# EasyEDA Pro project esp8266.eprj

# Schematic esp8266
Create Date: 2022-06-22; Project Name: esp8266; Schematic Name: esp8266; Update Date: 2022-10-05
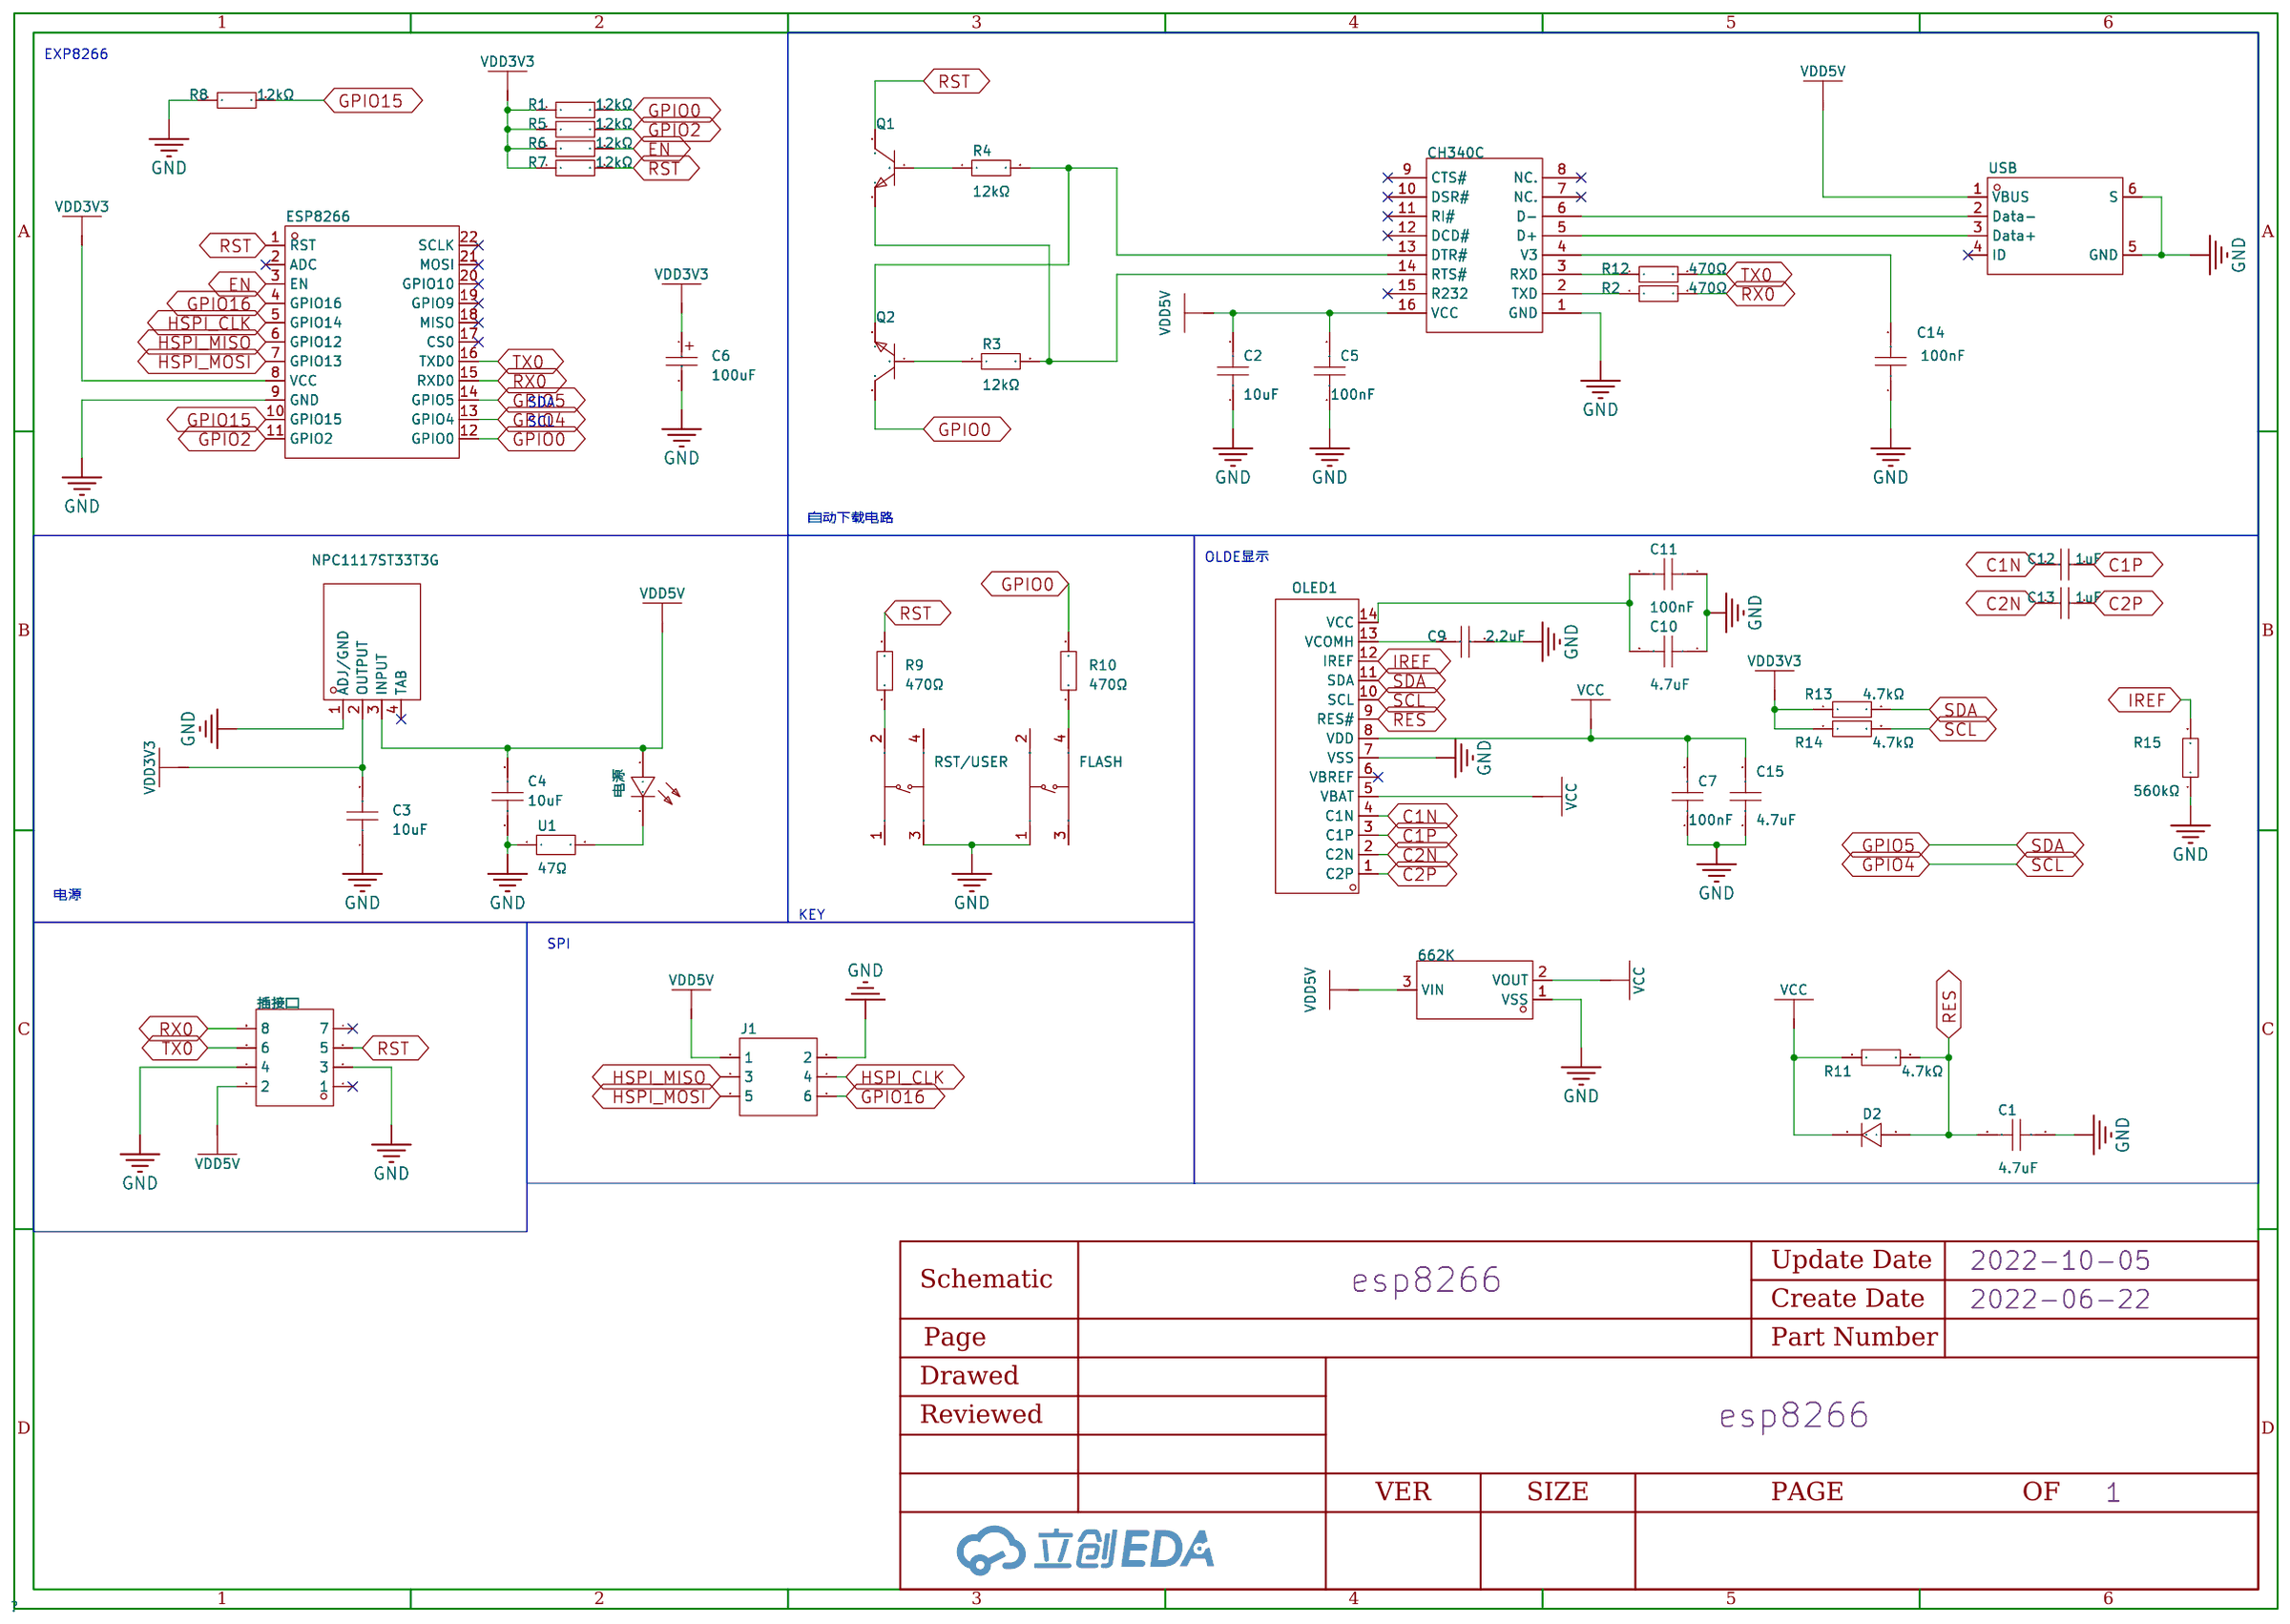
[diagram p0: schematic sheet]

## Parts
662K  -  [SOT-23-3_L2.9-W1.3-P1.90-LS2.4-BR]
C1  4.7uF  [C0805]
C2  10uF  [C0805]
C3  10uF  [C0805]
C4  10uF  [C0805]
C5  100nF  [C0805]
C6  100uF  [CAP-SMD_L3.5-W2.8-R-RD]
C7  100nF  [C0805]
C9  2.2uF  [C0805]
C10  4.7uF  [C0805]
C11  100nF  [C0805]
C12  1uF  [C0805]
C13  1uF  [C0805]
C14  100nF  [C0805]
C15  4.7uF  [C0805]
CH340C  -  [SOP-16_L10.0-W3.9-P1.27-LS6.0-BL]
D2  -  [SOD-323_L1.8-W1.3-LS2.5-RD]
ESP8266  -  [WIFIM-SMD_ESP-12F-ESP8266MOD]
FLASH  -  [SW-TH_4P-L6.0-W6.0-P4.50-LS6.5]
J1  -  [HDR-TH_6P-P2.54-V-M-R2-C3-S2.54-1]
NPC1117ST33T3G  -  [SOT-223-3_L6.5-W3.4-P2.30-LS7.0-BR]
OLED1  -  [OLED_QG-2832TLBFG02]
Q1  -  [SOT-23-3_L2.9-W1.3-P1.90-LS2.4-BR]
Q2  -  [SOT-23-3_L2.9-W1.3-P1.90-LS2.4-BR]
R1  12kΩ  [R0805]
R2  470Ω  [R0805]
R3  12kΩ  [R0805]
R4  12kΩ  [R0805]
R5  12kΩ  [R0805]
R6  12kΩ  [R0805]
R7  12kΩ  [R0805]
R8  12kΩ  [R0805]
R9  470Ω  [R0805]
R10  470Ω  [R0805]
R11  4.7kΩ  [R0805]
R12  470Ω  [R0805]
R13  4.7kΩ  [R0805]
R14  4.7kΩ  [R0805]
R15  560kΩ  [R0805]
RST/USER  -  [SW-TH_4P-L6.0-W6.0-P4.50-LS6.5]
U1  47Ω  [RES-TH_BD2.3-L3.7-P7.70-D0.4]
USB  -  [MICRO-USB-SMD_10118194-0001LF]
插接口  -  [HDR-TH_8P-P2.54-H-R2-C4-S2.54-W10.0_A2541WR]
电源  -  [LED-TH_BD3.0-P2.54-FD]

## Library data of the parts
662K = 662K.: 输出类型:-;; Supplier Part: C841298; Manufacturer: FM富满; Supplier Footprint: SOT-23-3; JLCPCB Part Class: Extended Part; Datasheet: https://atta.szlcsc.com/upload/public/pdf/watermark/20200922/C841298_3E220732626B158CD6AC195AF78C7FB8.pdf; Supplier: LCSC
C1 C15 = TMK212ABJ475KG-T: 容值:4.7uF;精度:±10%;额定电压:25V;温度系数:X5R;; LCSC Part Name: 4.7uF ±10% 25V; Supplier Part: C386082; Manufacturer: TAIYO YUDEN(太诱); Supplier Footprint: 0805; JLCPCB Part Class: Extended Part; Datasheet: https://atta.szlcsc.com/upload/public/pdf/source/20190515/C386082_C860CF0EB34FBC4D1D57494187A636A7.pdf; Supplier: LCSC; Tolerance: ±10%; Voltage Rated: 25V; Temperature Coefficient: X5R
C2-C4 = GRT21BC71E106KE13L: 容值:10uF;精度:±10%;额定电压:-;温度系数:-;; LCSC Part Name: 10uF ±10%; Supplier Part: C882505; Manufacturer: muRata(村田); Supplier Footprint: 0805; JLCPCB Part Class: Extended Part; Datasheet: https://atta.szlcsc.com/upload/public/pdf/source/20201228/C882505_6C63D8D57C6472D033E3095FB59E12C2.pdf; Supplier: LCSC; Tolerance: ±10%
C5 C7 C11 C14 = C0805X104K101T: 容值:100nF;精度:±10%;额定电压:100V;温度系数:X7R;; LCSC Part Name: 100nF ±10% 100V; Supplier Part: C485772; Manufacturer: IHHEC(禾伸堂); Supplier Footprint: 0805; JLCPCB Part Class: Extended Part; Datasheet: https://atta.szlcsc.com/upload/public/pdf/source/20200117/C485772_1C2A03D89DC7D3F931FB9AFBA2903E68.pdf; Supplier: LCSC; Tolerance: ±10%; Voltage Rated: 100V; Temperature Coefficient: X7R
C6 = TAJB107M006RNJ: 容值:100uF;精度:±20%;额定电压:6.3V;等效串联电阻:1.7Ω@100kHz;工作温度:-55~+125;; LCSC Part Name: 100uF ±20% 6.3V; Supplier Part: C7195; Manufacturer: AVX; Supplier Footprint: CASE-B_3528; JLCPCB Part Class: Extended Part; Datasheet: https://atta.szlcsc.com/upload/public/pdf/source/20160107/1457707748770.pdf; Supplier: LCSC; Tolerance: ±20%; Rated Voltage: 6.3V; Equivalent Series Resistance(ESR): 1.7Ω@100kHz; Operating Temperature: -55~+125
C9 = CL21F225ZAFNNNE: 容值:2.2uF;精度:-20%~+80%;额定电压:25V;温度系数:Y5V;; LCSC Part Name: 2.2uF(225) +80,-20% 25V; Supplier Part: C1771; Manufacturer: SAMSUNG(三星); Supplier Footprint: 0805; JLCPCB Part Class: Extended Part; Datasheet: https://atta.szlcsc.com/upload/public/pdf/source/20160103/1457707695970.pdf; Supplier: LCSC; Tolerance: -20%~+80%; Voltage Rated: 25V; Temperature Coefficient: Y5V
C10 = GRM219B31A475KE33D: 容值:4.7uF;精度:±10%;额定电压:-;温度系数:-;; LCSC Part Name: 4.7uF ±10%; Supplier Part: C913642; Manufacturer: muRata(村田); Supplier Footprint: 0805; JLCPCB Part Class: Extended Part; Datasheet: https://atta.szlcsc.com/upload/public/pdf/source/20201110/C913642_F7322AB3A970D02668ACBCDF0CD0643B.pdf; Supplier: LCSC; Tolerance: ±10%
C12 C13 = CL21F105ZOFNNNE: 容值:1uF;精度:-20%~+80%;额定电压:16V;温度系数:Y5V;; LCSC Part Name: 1uF(105) +80,-20% 16V; Supplier Part: C16834; Manufacturer: SAMSUNG(三星); Supplier Footprint: 0805; JLCPCB Part Class: Extended Part; Datasheet: https://atta.szlcsc.com/upload/public/pdf/source/20160103/1457707690495.pdf; Supplier: LCSC; Tolerance: -20%~+80%; Voltage Rated: 16V; Temperature Coefficient: Y5V
CH340C = CH340C: 类型:Transceiver;协议类别:USB 2.0;驱动器/接收器数:-;数据速率:2Mbps;; Supplier Part: C84681; Manufacturer: WCH(南京沁恒); Supplier Footprint: SOP-16_150mil; JLCPCB Part Class: Extended Part; Datasheet: https://atta.szlcsc.com/upload/public/pdf/source/20200819/C84681_ADBED554CE321879DBD6B1D06488689C.pdf; Supplier: LCSC; Type: Transceiver; Protocol: USB 2.0; Data Rate: 2Mbps; Supply Voltage: 3.3V, 5V
D2 = 1N4148WS: 二极管配置:独立式;功率:200mW;直流反向耐压(Vr):100V;平均整流电流(Io):150mA;正向压降(Vf):1.25V@150mA;反向电流(Ir):1A@75V;反向恢复时间(trr):4ns;工作温度:+150@(Tj);; LCSC Part Name: 100V 150mA 4ns T4; Supplier Part: C2128; Manufacturer: CJ（江苏长电/长晶）; Supplier Footprint: SOD-323; JLCPCB Part Class: Basic Part; Datasheet: https://atta.szlcsc.com/upload/public/pdf/source/20140809/1457707208178.pdf; Supplier: LCSC; Diode Configuration: 独立式; Power Dissipation: 200mW; Reverse Voltage (Vr): 100V; Average Rectified Current (Io): 150mA; Forward Voltage (Vf@If): 1.25V@150mA; Reverse Leakage Current: 1A@75V; Reverse Recovery Time (trr): 4ns; Operating Temperature: +150@(Tj)
ESP8266 = ESP-12F(ESP8266MOD): 屏蔽罩上的丝印是：ESP8266MOD，ESP8266EX串口WIFI; Supplier Part: C82891; Manufacturer: Ai-Thinker(安信可); Supplier Footprint: WIFI Module; JLCPCB Part Class: Extended Part; Datasheet: https://atta.szlcsc.com/upload/public/pdf/source/20210219/C82891_ABD84A460F4F056A2757267CCCA4B508.pdf; Supplier: LCSC
FLASH RST/USER = TS665CJ: 触点电流:50mA;额定电压(DC):12V;电路结构:单刀单掷;安装方式:直插;按钮形状:圆形按钮;带灯:-;开关长度:6mm;开关宽度:6mm;开关高度:5mm;; LCSC Part Name: 6*6*5插件立式直插6x6dip按键轻触开关; Supplier Part: C393938; Manufacturer: SHOU HAN(首韩); Supplier Footprint: 插件; JLCPCB Part Class: Extended Part; Datasheet: https://atta.szlcsc.com/upload/public/pdf/source/20190521/C393938_BDABEAC600B4C55E200A80AA129B70BC.pdf; Supplier: LCSC; Contact Current: 50mA; Voltage Rating (DC): 12V; Circuit: 单刀单掷; Mounting Style: 直插; Actuator Style: 圆形按钮; Switch Length: 6mm; Switch Width: 6mm; Switch Height: 5mm
J1 = 2.54-2*3P针: 间距:2.54mm;总PIN位数:6;排数:2;插针结构:-;行距:-;安装类型:直插;圆针/方针:-;额定电流:-;额定电压:-;配合针长度:-;塑高:-;触头材质:-;触头镀层:-;颜色:黑色;; LCSC Part Name: 2.54mm; Supplier Part: C65114; Manufacturer: BOOMELE(博穆精密); Supplier Footprint: 插件,P=2.54mm; JLCPCB Part Class: Extended Part; Supplier: LCSC; Pitch: 2.54mm; Number of Pins: 6; Number of Rows: 2; Mounting Type: 直插; Color: 黑色
NPC1117ST33T3G = NCP1117ST33T3G: 输出类型:固定;输出极性:正;输出通道数:1;最大输入电压:20V;输出电压:3.3V;压差:1.2V@(800mA);输出电流:1A;电源纹波抑制比(PRSS):64dB@(120Hz);; LCSC Part Name: Vin=20V Vout=3.3V 1A 64dB@(120Hz); Supplier Part: C26537; Manufacturer: onsemi(安森美); Supplier Footprint: SOT-223; JLCPCB Part Class: Extended Part; Datasheet: https://atta.szlcsc.com/upload/public/pdf/source/20140314/1457707016292.pdf; Supplier: LCSC; Output Type: 固定; Output Polarity: 正; Number of Outputs: 1; Maximum Input Voltage: 20V; Output Voltage: 3.3V; Dropout Voltage: 1.2V@(800mA); Output Current: 1A; Power Supply Rejection Ratio (PRSS): 64dB@(120Hz)
OLED1 = QG-2832TLBFG02: LCSC Part Name: QG-2832TLBFG02 蓝光14pinSSD1306; Supplier Part: C91220; Manufacturer: 全智景Allvision; Supplier Footprint: 0.91"128x32; JLCPCB Part Class: Extended Part; Datasheet: https://atta.szlcsc.com/upload/public/pdf/source/20170511/1494500131666.pdf; Supplier: LCSC
Q1 Q2 = MMBT3904: 晶体管类型:NPN;集射极击穿电压(Vceo):40V;集电极电流(Ic):200mA;功率(Pd):200mW;集电极-发射极饱和电压(VCE(sat)@Ic,Ib):300mV@50mA,5mA;直流电流增益(hFE@Ic,Vce):100@10mA,1V;特征频率(fT):300MHz;工作温度:+150@(Tj);; LCSC Part Name: MMBT3904 1AM 100-300 1AM  100-300; Supplier Part: C20526; Manufacturer: CJ（江苏长电/长晶）; Supplier Footprint: SOT-23(SOT-23-3); JLCPCB Part Class: Basic Part; Datasheet: https://atta.szlcsc.com/upload/public/pdf/source/20140809/1457707206600.pdf; Supplier: LCSC; Transistor Type: NPN; Collector-Emitter Breakdown Voltage (Vceo): 40V; Collector Current (Ic): 200mA; Power Dissipation (Pd): 200mW; Collector-Emitter Saturation Voltage (VCE(sat)@Ic,Ib): 300mV@50mA,5mA; DC Current Gain (hFE@Ic,Vce): 100@10mA,1V; Transition Frequency (fT): 300MHz; Operating Temperature: +150@(Tj)
R1 R3-R8 = 0805W8F1202T5E: 电阻类型:厚膜电阻;阻值:12kΩ;精度:±1%;功率:125mW;温度系数:±100ppm/;最大工作电压:150V;工作温度范围:-55~+155;; LCSC Part Name: 12kΩ ±1%; Supplier Part: C17444; Manufacturer: UNI-ROYAL(厚声); Supplier Footprint: 0805; JLCPCB Part Class: Basic Part; Datasheet: https://atta.szlcsc.com/upload/public/pdf/source/20200306/C422600_1E6D84923E4A46A82E41ADD87F860B5C.pdf; Supplier: LCSC; Type: 厚膜电阻; Tolerance: ±1%; Power(Watts): 125mW; Temperature Coefficient: ±100ppm/; Overload Voltage (Max): 150V; Operating Temperature Range: -55~+155
R2 R9 R10 R12 = RS-05K4700FT: 阻值:470Ω;精度:±1%;功率:125mW;温度系数:±100ppm/;最大工作电压:100V;工作温度范围:-55~+155;; LCSC Part Name: 470Ω ±1%; Supplier Part: C136570; Manufacturer: FH(风华); Supplier Footprint: 0805; JLCPCB Part Class: Extended Part; Datasheet: https://atta.szlcsc.com/upload/public/pdf/source/20171106/C136570_15099531895241092516.pdf; Supplier: LCSC; Tolerance: ±1%; Power(Watts): 125mW; Temperature Coefficient: ±100ppm/; Overload Voltage (Max): 100V; Operating Temperature Range: -55~+155
R11 R13 R14 = RMC08054.7K1%N: 阻值:4.7kΩ;精度:±1%;功率:0.125W;; LCSC Part Name: 4.7kΩ ±1%; Supplier Part: C269746; Manufacturer: Tyohm(幸亚电阻); Supplier Footprint: 0805; JLCPCB Part Class: Extended Part; Datasheet: https://atta.szlcsc.com/upload/public/pdf/source/20190115/C269746_3EA3C7E4490C68712FA44CA03852E2BD.pdf; Supplier: LCSC; Tolerance: ±1%; Power(Watts): 0.125W
R15 = 0805W8F5603T5E: 电阻类型:厚膜电阻;阻值:560kΩ;精度:±1%;功率:1/8W;温度系数:±100ppm/;最大工作电压:150V;工作温度范围:-55~+155;; LCSC Part Name: 560kΩ ±1%; Supplier Part: C15785; Manufacturer: UNI-ROYAL(厚声); Supplier Footprint: 0805; JLCPCB Part Class: Extended Part; Datasheet: https://atta.szlcsc.com/upload/public/pdf/source/20200306/C422600_1E6D84923E4A46A82E41ADD87F860B5C.pdf; Supplier: LCSC; Type: 厚膜电阻; Tolerance: ±1%; Power(Watts): 1/8W; Temperature Coefficient: ±100ppm/; Overload Voltage (Max): 150V; Operating Temperature Range: -55~+155
U1 = MF1/8W-47Ω±1%-OT52: 电阻类型:金属膜电阻;阻值:47Ω;精度:±1%;功率:125mW;温度系数:±350ppm/;最大工作电压:200V;工作温度范围:-55~+155;; LCSC Part Name: 47Ω ±1% 125mW; Supplier Part: C2848560; Manufacturer: VO(翔胜); Supplier Footprint: 轴向引线,2.3x3.7mm; Datasheet: https://atta.szlcsc.com/upload/public/pdf/source/20200609/C601728_5AA4C0C8E12E11069DA2C3356F29D1F2.pdf; Supplier: LCSC; Type: 金属膜电阻; Tolerance: ±1%; Power(Watts): 125mW; Temperature Coefficient: ±350ppm/; Overload Voltage (Max): 200V; Operating Temperature Range: -55~+155
USB = 10118194-0001LF: 连接器类型:Micro-B;标准:USB 2.0;公母:母座;触点数量:5;端口数量:1;; LCSC Part Name: Micro-B 母座; Supplier Part: C132563; Manufacturer: Amphenol; Supplier Footprint: SMD; JLCPCB Part Class: Extended Part; Datasheet: https://atta.szlcsc.com/upload/public/pdf/source/20210630/C132563_323781699BE9D7BFAD8DF70EA5820798.pdf; Supplier: LCSC; Connector Type: Micro-B; Standard: USB 2.0; Gender: 母座; Number of Contacts: 5; Number of Ports: 1
插接口 = A2541WR-2x4P: 间距:2.54mm;总PIN位数:8;排数:2;插针结构:2x4P;行距:2.54mm;安装类型:弯插;圆针/方针:方针;额定电流:-;额定电压:-;配合针长度:6mm;塑高:2.54mm;触头材质:黄铜;触头镀层:-;工作温度范围:-40~+105;颜色:黑色;; LCSC Part Name: 2.54mm 2x4P; Supplier Part: C239335; Manufacturer: CJT(长江连接器); Supplier Footprint: 插件,P=2.54mm; JLCPCB Part Class: Extended Part; Datasheet: https://atta.szlcsc.com/upload/public/pdf/source/20180724/C239335_1CBAC3B8C59C1FC155DA41FC3F737A16.pdf; Supplier: LCSC; Pitch: 2.54mm; Number of Pins: 8; Number of Rows: 2; Pin Structure: 2x4P; Row Spacing: 2.54mm; Mounting Type: 弯插; Circluar Pins/Square Pins: 方针; Length of Mating Pin: 6mm; Insulation Height: 2.54mm; Contact Material: 黄铜; Operating Temperature Range: -40~+105; Color: 黑色
电源 = 204-10SURD/S530-A3-L: 发光颜色:红灯;二极管配置:-;透镜颜色:雾状红;主波长:624nm;峰值波长:632nm;色温:-;光通量(25时):-;测试电流:20mA;正向电压(VF):2V;发光强度:80mcd;功率:60mW;发光角度:40°;安装方式:-;工作温度:-40~+85;; LCSC Part Name: 红色; Supplier Part: C99771; Manufacturer: EVERLIGHT(台湾亿光); Supplier Footprint: 插件,φ=3mm; JLCPCB Part Class: Extended Part; Datasheet: https://atta.szlcsc.com/upload/public/pdf/source/20170504/1493866972127.pdf; Supplier: LCSC; Emitted Color: 红灯; Lens Color: 雾状红; Dominant Wavelength: 624nm; Peak Wavelength: 632nm; Forward Current: 20mA; Forward Voltage (VF): 2V; Luminous Intensity: 80mcd; Power Dissipation: 60mW; Viewing Angle: 40°; Operating Temperature: -40~+85

## Nets
GND: 662K.1(VSS) C1.1 C2.1 C3.1 C4.1 C5.1 C6.2 C7.1 C9.1 C10.1 C11.1 C14.1 C15.1 CH340C.1(GND) ESP8266.9(GND) FLASH.1(A) J1.2 NPC1117ST33T3G.1(ADJ/GND) OLED1.7(VSS) R8.1 R15.1 RST/USER.3(C) U1.1 USB.5(GND) USB.6(S) 插接口.3 插接口.4
VCC: 662K.2(VOUT) C7.2 C15.2 D2.1(K) OLED1.5(VBAT) OLED1.8(VDD) R11.1
VDD3V3: C3.2 C6.1 ESP8266.8(VCC) NPC1117ST33T3G.2(OUTPUT) R1.1 R5.1 R6.1 R7.1 R13.1 R14.1
VDD5V: 662K.3(VIN) C2.2 C4.2 C5.2 CH340C.16(VCC) J1.1 NPC1117ST33T3G.3(INPUT) USB.1(VBUS) 插接口.2 电源.1(A)
C1N: C12.2 OLED1.4(C1N)
C1P: C12.1 OLED1.3(C1P)
C2N: C13.1 OLED1.2(C2N)
C2P: C13.2 OLED1.1(C2P)
EN: ESP8266.3(EN) R6.2
GPIO0: ESP8266.12(GPIO0) Q2.3(C) R1.2 R10.2
GPIO2: ESP8266.11(GPIO2) R5.2
GPIO4: ESP8266.13(GPIO4) OLED1.10(SCL) R14.2
GPIO5: ESP8266.14(GPIO5) OLED1.11(SDA) R13.2
GPIO15: ESP8266.10(GPIO15) R8.2
GPIO16: ESP8266.4(GPIO16) J1.6
HSPI_CLK: ESP8266.5(GPIO14) J1.4
HSPI_MISO: ESP8266.6(GPIO12) J1.3
HSPI_MOSI: ESP8266.7(GPIO13) J1.5
IREF: OLED1.12(IREF) R15.2
RES: C1.2 D2.2(A) OLED1.9(RES#) R11.2
RST: ESP8266.1(RST) Q1.3(C) R7.2 R9.2 插接口.5
RX0: ESP8266.15(RXD0) R2.2 插接口.8
TX0: ESP8266.16(TXD0) R12.2 插接口.6
$1N2489: CH340C.5(D+) USB.3(Data+)
$1N2492: CH340C.6(D-) USB.2(Data-)
$1N4762: CH340C.2(TXD) R2.1
$1N5427: CH340C.14(RTS#) Q1.2(E) R3.2
$1N6150: Q1.1(B) R4.1
$1N6309: Q2.1(B) R3.1
$1N11619: R9.1 RST/USER.2(B)
$1N11632: FLASH.4(D) R10.1
$1N12597: CH340C.13(DTR#) Q2.2(E) R4.2
$1N12808: CH340C.3(RXD) R12.1
$1N12994: C14.2 CH340C.4(V3)
$1N28480: C10.2 C11.2 OLED1.14(VCC)
$1N28820: C9.2 OLED1.13(VCOMH)
$1N39199: U1.2 电源.2(K)

Not connected (* = marked no-connect by the designer): CH340C 7(NC.)* 8(NC.)* 9(CTS#)* 10(DSR#)* 11(RI#)* 12(DCD#)* 15(R232)*; ESP8266 2(ADC)* 17(CS0)* 18(MISO)* 19(GPIO9)* 20(GPIO10)* 21(MOSI)* 22(SCLK)*; FLASH 2(B) 3(C); NPC1117ST33T3G 4(TAB)*; OLED1 6(VBREF)*; RST/USER 1(A) 4(D); USB 4(ID)*; 插接口 1* 7*

## Notes on the sheet
- EXP8266
- SDA
- SCL
- 自动下载电路
- OLDE显示
- 电源
- KEY
- SPI

# Board PCB1
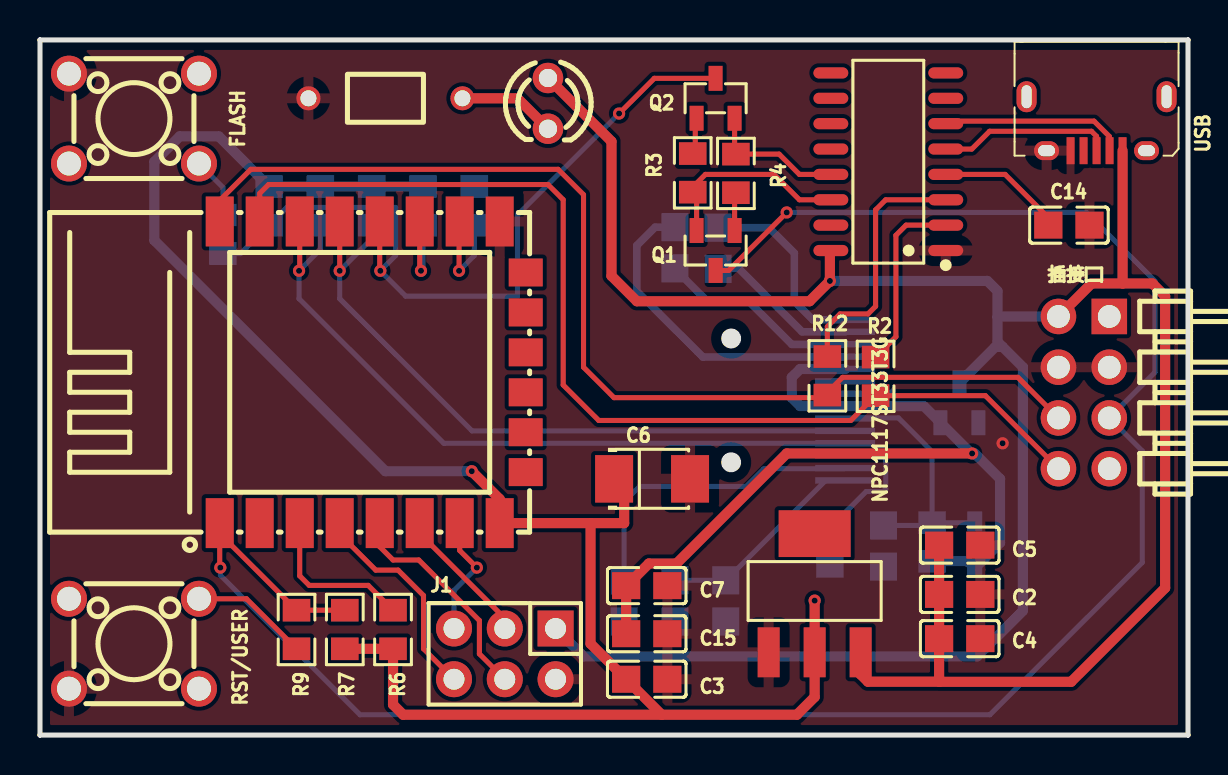
[diagram p1: board, top side]
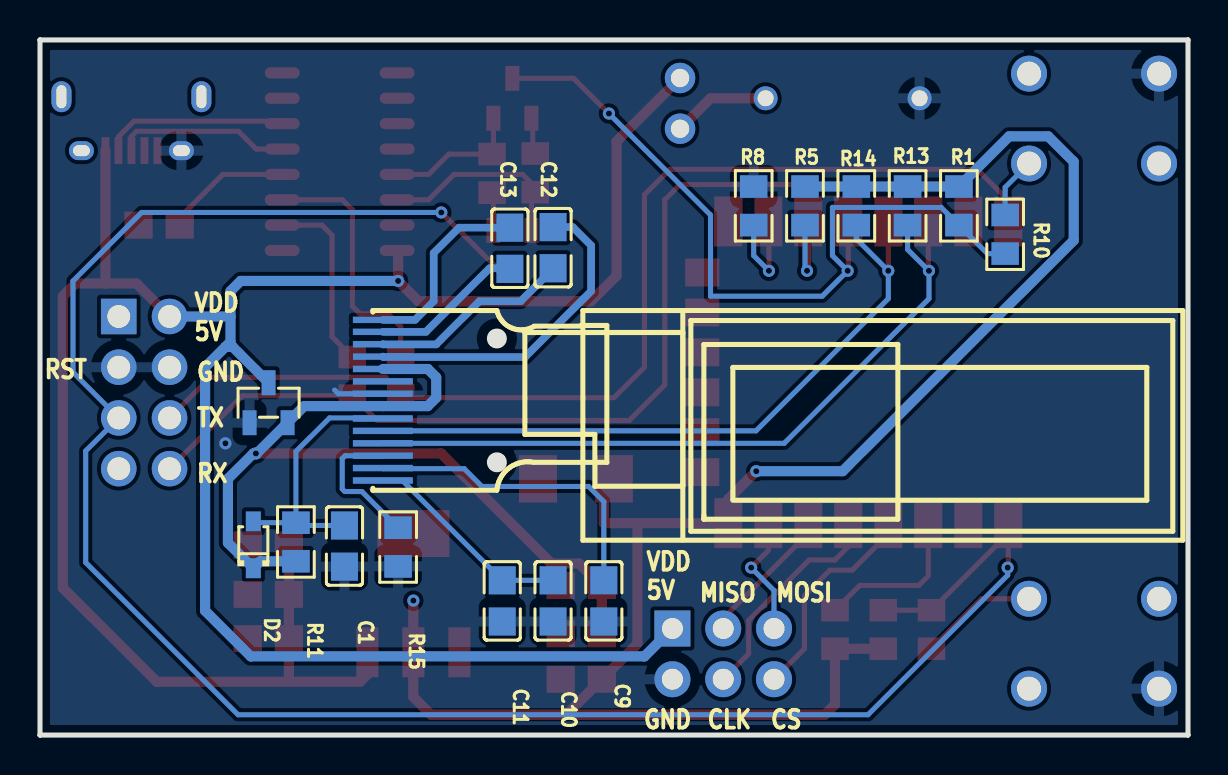
[diagram p2: board, bottom side, seen from below]

Outline 57.4 x 34.8 mm; copper layers: Top Layer, Bottom Layer. Coordinates in mm from the lower left corner of the outline.
Outline path: 0,34.8 0,0 arc(0,0) 0,0 57.4,0 57.4,34.8 0,34.8 arc(0,34.8) 0,34.8
Stack: Top Layer 0.035mm / Dielectric1 1.51mm FR4 er 4.5 / Bottom Layer 0.035mm

## Design rules (mm)
spacing safeClearance (default): track to track 0.152, other pairs 0.152 to 0.3
track width trackWidth (default): min 0.127, default 0.254, max 2.54
differential pair differentialPair (default): width min 0.127, default 0.254, max 2.54; gap min 0.152, default 0.152
via viaSize (default): diameter min 0.5, default 0.61, max 10; hole min 0.3, default 0.305, max 6

## Placement (name value [footprint] x y rotation side)
662K  -  [SOT-23-3_L2.9-W1.3-P1.90-LS2.4-BR]  45.97 16.64 270 bottom
C1  4.7uF  [C0805]  42.18 9.46 90 bottom
C2  10uF  [C0805]  45.99 7.04 180 top
C3  10uF  [C0805]  30.34 2.79 180 top
C4  10uF  [C0805]  45.99 4.83 180 top
C5  100nF  [C0805]  45.99 9.51 180 top
C6  100uF  [CAP-SMD_L3.5-W2.8-R-RD]  30.61 12.83 180 top
C7  100nF  [C0805]  30.34 7.48 180 top
C9  2.2uF  [C0805]  29.21 6.72 90 bottom
C10  4.7uF  [C0805]  31.75 6.72 90 bottom
C11  100nF  [C0805]  34.29 6.72 90 bottom
C12  1uF  [C0805]  31.75 24.4 90 bottom
C13  1uF  [C0805]  33.91 24.37 90 bottom
C14  100nF  [C0805]  51.45 25.53 180 top
C15  4.7uF  [C0805]  30.34 5.07 180 top
CH340C  -  [SOP-16_L10.0-W3.9-P1.27-LS6.0-BL]  42.42 28.7 90 top
D2  -  [SOD-323_L1.8-W1.3-LS2.5-RD]  46.74 9.53 90 bottom
ESP8266  -  [WIFIM-SMD_ESP-12F-ESP8266MOD]  16.64 18.16 0 top
FLASH  -  [SW-TH_4P-L6.0-W6.0-P4.50-LS6.5]  4.7 30.86 0 top
J1  -  [HDR-TH_6P-P2.54-V-M-R2-C3-S2.54-1]  23.24 4.06 180 top
NPC1117ST33T3G  -  [SOT-223-3_L6.5-W3.4-P2.30-LS7.0-BR]  38.73 7.11 270 top
OLED1  -  [OLED_QG-2832TLBFG02]  40.26 16.76 90 bottom
Q1  -  [SOT-23-3_L2.9-W1.3-P1.90-LS2.4-BR]  33.78 24.26 90 top
Q2  -  [SOT-23-3_L2.9-W1.3-P1.90-LS2.4-BR]  33.78 31.88 270 top
R1  12kΩ  [R0805]  11.46 26.49 270 bottom
R2  470Ω  [R0805]  41.78 17.96 270 top
R3  12kΩ  [R0805]  32.64 28.14 270 top
R4  12kΩ  [R0805]  34.8 28.12 90 top
R5  12kΩ  [R0805]  19.15 26.49 270 bottom
R6  12kΩ  [R0805]  17.65 5.28 90 top
R7  12kΩ  [R0805]  15.24 5.28 90 top
R8  12kΩ  [R0805]  21.72 26.49 270 bottom
R9  470Ω  [R0805]  12.83 5.28 90 top
R10  470Ω  [R0805]  9.14 25.07 270 bottom
R11  4.7kΩ  [R0805]  44.61 9.67 90 bottom
R12  470Ω  [R0805]  39.37 17.98 270 top
R13  4.7kΩ  [R0805]  14.02 26.49 270 bottom
R14  4.7kΩ  [R0805]  16.59 26.49 270 bottom
R15  560kΩ  [R0805]  39.5 9.41 90 bottom
RST/USER  -  [SW-TH_4P-L6.0-W6.0-P4.50-LS6.5]  4.7 4.57 0 top
U1  47Ω  [RES-TH_BD2.3-L3.7-P7.70-D0.4]  17.27 31.88 0 top
USB  -  [MICRO-USB-SMD_10118194-0001LF]  52.83 30.61 180 top
插接口  -  [HDR-TH_8P-P2.54-H-R2-C4-S2.54-W10.0_A2541WR]  52.2 17.15 270 top
电源  -  [LED-TH_BD3.0-P2.54-FD]  25.4 31.62 270 top

## Footprints (pads in the part's own frame, mm; a bottom-side part is the same pattern mirrored in y, then rotated)
C0805
  rect 1.41x1.35 smd: 1(-1.03,0) 2(1.03,0)
CAP-SMD_L3.5-W2.8-R-RD
  rect 1.9x2.375 smd: 1(1.9,0) 2(-1.897,0)
HDR-TH_6P-P2.54-V-M-R2-C3-S2.54-1
  rect 1.801x1.801 hole 1.049: 1(-2.54,-1.27)
  round 1.801 hole 1.049: 2(-2.54,1.27) 3(0,-1.27) 4(0,1.27) 5(2.54,-1.27) 6(2.54,1.27)
HDR-TH_8P-P2.54-H-R2-C4-S2.54-W10.0_A2541WR
  rect 1.778x1.778 hole 1.143: 1(-3.81,1.27)
  round 1.778 hole 1.143: 2(-3.81,-1.27) 3(-1.27,1.27) 4(-1.27,-1.27) 5(1.27,1.27) 6(1.27,-1.27) 7(3.81,1.27) 8(3.81,-1.27)
LED-TH_BD3.0-P2.54-FD
  round 1.524 hole 0.914: 1(-1.27,0) 2(1.27,0)
MICRO-USB-SMD_10118194-0001LF
  rect 0.399x1.351 smd: 1(-1.3,1.351) 2(-0.65,1.351) 3(0,1.351) 4(0.65,1.351) 5(1.3,1.351)
  oval 1.001x1.55 hole 0.5x1.151: 6(-3.5,-1.349) 6(3.5,-1.349)
  oval 1.25x0.95 hole 0.851x0.551: 6(-2.499,1.351) 6(2.499,1.351)
OLED_QG-2832TLBFG02
  rect 0.32x2.999 smd: 1(4.021,0) 2(3.421,0) 3(2.801,0) 4(2.182,0) 5(1.562,0) 6(0.943,0) 7(0.323,0) 8(-0.297,0) 9(-0.917,0) 10(-1.536,0) 11(-2.159,0) 12(-2.779,0) 13(-3.398,0) 14(-4.019,0)
R0805
  rect 1.133x1.377 smd: 1(-0.966,0) 2(0.966,0)
RES-TH_BD2.3-L3.7-P7.70-D0.4
  round 1.2 hole 0.8: 1(-3.85,0) 2(3.85,0)
SOD-323_L1.8-W1.3-LS2.5-RD
  rect 1x0.75 smd: 1(-1.173,0) 2(1.173,0)
SOP-16_L10.0-W3.9-P1.27-LS6.0-BL
  oval 0.56x1.745 smd: 1(-4.445,-2.873) 2(-3.175,-2.873) 3(-1.905,-2.873) 4(-0.635,-2.873) 5(0.635,-2.873) 6(1.905,-2.873) 7(3.175,-2.873) 8(4.445,-2.873) 9(4.445,2.873) 10(3.175,2.873) 11(1.905,2.873) 12(0.635,2.873) 13(-0.635,2.873) 14(-1.905,2.873) 15(-3.175,2.873) 16(-4.445,2.873)
SOT-23-3_L2.9-W1.3-P1.90-LS2.4-BR
  rect 1.25x0.7 smd: 1(1,-0.95) 2(1,0.95) 3(-1,0)
SOT-223-3_L6.5-W3.4-P2.30-LS7.0-BR
  rect 2.5x1.1 smd: 1(2.97,-2.3) 2(2.97,0) 3(2.97,2.3)
  rect 2.34x3.6 smd: 4(-2.97,0)
SW-TH_4P-L6.0-W6.0-P4.50-LS6.5
  round 1.8 hole 1.2: 1(-3.25,2.25) 2(3.25,2.25) 3(-3.25,-2.25) 4(3.25,-2.25)
WIFIM-SMD_ESP-12F-ESP8266MOD
  rect 1.399x2.499 smd: 1(-7.651,-7.551) 2(-5.652,-7.551) 3(-3.65,-7.551) 4(-1.651,-7.551) 5(0.35,-7.551) 6(2.349,-7.551) 7(4.348,-7.551) 8(6.35,-7.551) 9(6.35,7.549) 10(4.348,7.551) 11(2.349,7.551) 12(0.35,7.551) 13(-1.651,7.549) 14(-3.65,7.551) 15(-5.652,7.551) 16(-7.651,7.551)
  rect 1.7x1.399 smd: 17(7.651,-4.998) 18(7.648,-3.002) 19(7.651,-1.004) 20(7.651,0.998) 21(7.651,2.997) 22(7.651,4.996)

## Nets
As in the schematic.

Pads without a net: CH340C 7 8 9 10 11 12 15; ESP8266 2 17 18 19 20 21 22; FLASH 2 3; NPC1117ST33T3G 4; OLED1 6; RST/USER 1 4; USB 4; 插接口 1 7

## Via types
v1: diameter 0.61, hole 0.305, Top Layer to Bottom Layer, 14 vias

## Routing (per net, layer and track width the routed paths; a pad name or vN(x,y) marks a point on that pad's centre or on a via; arc(x,y) is an arc through that point)
GND: length 2.5
  Bottom Layer w0.254: OLED1.7 42.49,17.09 42.67,17.27
  vias: v1(48.13,14.61)
VCC: length 45.7
  Top Layer w0.508: v1(46.61,14.1) 37.34,14.1 31.83,8.59 30.45,8.59 29.34,7.48 C7.2 C15.2
  Bottom Layer w0.508: R11.1 46.39,8.7 D2.1 48.01,9.62 48.01,12.83 46.74,14.1 46.56,14.1 44.19,16.47 OLED1.8 38.02,16.47 37.59,16.89 37.59,17.91 38.01,18.33 OLED1.5
VDD3V3: length 94.6
  Top Layer w0.508: 17.65,4.32 17.65,1.52 18.16,1.02 31.09,1.02 ; 17.65,4.32 15.24,4.32 ; 17.65,4.32 17.72,4.32 ; 27.53,10.61 27.53,4.57 C3.2 31.09,1.02 ; 27.53,10.61 ESP8266.8 22.99,11.81 v1(21.59,13.21) ; 27.53,10.61 29.21,10.61 29.21,12.32 28.8,12.74 28.74,12.74 28.74,12.8 C6.1 ; 31.09,1.02 37.85,1.02 38.73,1.91 NPC1117ST33T3G.2 v1(38.73,6.73) ; 17.72,4.32 17.84,4.32 17.78,4.25 17.72,4.32
  Bottom Layer w0.508: R5.1 R14.1 R13.1 R1.1 8.94,29.97 6.98,29.97 5.71,28.7 5.71,24.77 17.27,13.21 v1(21.59,13.21)
VDD5V: length 133.4
  Top Layer w0.508: 54.13,22.61 52.58,22.61 插接口.2 ; 54.13,22.61 55.63,22.61 56.26,21.97 56.26,7.37 51.56,2.67 44.96,2.67 44.96,2.67 ; 54.13,22.61 USB.1 ; NPC1117ST33T3G.3 41.03,3.03 41.4,2.67 44.96,2.67 ; 电源.1 28.58,29.72 28.58,22.99 29.84,21.72 38.48,21.72 v1(39.5,22.73) 39.5,24.21 CH340C.16 ; C5.2 C2.2 C4.2 44.96,2.67
  Bottom Layer w0.508: v1(39.5,22.73) 47.37,22.73 47.88,22.23 47.88,20.93 ; 47.88,20.93 47.9,20.95 插接口.2 ; 47.88,20.93 47.88,19.69 48.13,19.43 ; 48.13,19.43 47.77,19.43 662K.3 ; 48.13,19.43 49.15,18.42 49.15,6.22 46.86,3.94 27.18,3.94 J1.1
C1N: length 16.4
  Bottom Layer w0.381: 40.26,18.95 40.24,18.92 33.15,18.92 29.84,22.23 29.84,24.51 30.76,25.43 C12.2
C1P: length 10.1
  Bottom Layer w0.381: C12.1 31.75,23.34 33.37,21.72 35.43,21.72 37.59,19.56 40.25,19.56 OLED1.3
C2N: length 7.7
  Bottom Layer w0.381: C13.1 33.94,23.37 34.92,23.37 38.11,20.19 OLED1.2
C2P: length 9.7
  Bottom Layer w0.381: C13.2 36.45,25.4 37.72,24.13 37.72,21.72 38.65,20.79 OLED1.1
EN: length 8
  Top Layer w0.254: 17.65,6.25 16.41,7.49 13.46,7.49 12.99,7.97 ESP8266.3
GPIO0: length 39.8
  Top Layer w0.254: v1(28.96,31.12) 30.72,32.88 Q2.3 ; ESP8266.12 16.99,23.27 v1(17.02,23.24)
  Bottom Layer w0.254: R10.2 10.03,24.1 R1.2 12.34,26.42 17.78,26.42 17.78,24 v1(17.02,23.24) 18.29,21.97 23.88,21.97 23.88,26.04 v1(28.96,31.12)
GPIO2: length 4.8
  Top Layer w0.254: v1(19.05,23.24) 18.99,23.3 ESP8266.11
  Bottom Layer w0.254: R5.2 19.15,23.34 v1(19.05,23.24)
GPIO4: length 34.8
  Top Layer w0.254: 14.99,25.71 v1(14.99,23.24)
  Bottom Layer w0.254: OLED1.10 21.6,15.23 14.99,21.84 v1(14.99,23.24) 16.59,24.84 R14.2
GPIO5: length 36.9
  Top Layer w0.254: v1(12.95,23.24) 12.99,23.27 ESP8266.14
  Bottom Layer w0.254: OLED1.11 20.19,14.61 12.95,21.84 v1(12.95,23.24) 14.02,24.31 R13.2
GPIO15: length 5.1
  Top Layer w0.254: v1(20.95,23.24) 20.95,25.68 ESP8266.10
  Bottom Layer w0.254: R8.2 21.72,24 v1(20.95,23.24)
GPIO16: length 10.8
  Top Layer w0.254: J1.6 19.18,4.32 19.18,6.98 17.91,8.26 16.79,8.26 14.99,10.06 14.99,10.61
HSPI_CLK: length 11.2
  Top Layer w0.254: J1.4 21.97,4.06 21.97,5.73 18.94,8.76 17.65,8.76 16.99,9.43 ESP8266.5
HSPI_MISO: length 7
  Top Layer w0.254: ESP8266.6 18.99,10.1 23.24,5.84 J1.3
HSPI_MOSI: length 6.1
  Top Layer w0.254: v1(21.84,8.38) 20.99,9.24 ESP8266.7
  Bottom Layer w0.254: v1(21.84,8.38) 20.7,7.24 J1.5
IREF: length 7.2
  Bottom Layer w0.254: R15.2 41.31,12.19 42.16,12.19 42.29,12.32 42.29,13.84 42.15,13.98 OLED1.12
RES: length 12.8
  Bottom Layer w0.254: R11.2 46.67,10.63 D2.2 ; R11.2 44.61,14.19 42.93,15.88 40.66,15.88 ; R11.2 44.47,10.49 C1.2
RST: length 102.9
  Top Layer w0.254: 15.24,6.25 12.83,6.25 8.99,10.09 ; 8.99,10.09 8.99,8.41 v1(9.02,8.38) ; 8.99,10.09 ESP8266.1 ; v1(37.34,26.16) 34.43,23.26 Q1.3
  Bottom Layer w0.254: v1(9.02,8.38) 9.02,8 16,1.02 47.5,1.02 55.12,8.64 55.12,14.22 插接口.5 55.75,18.16 55.75,22.73 52.32,26.16 v1(37.34,26.16)
RX0: length 53.9
  Top Layer w0.254: ESP8266.15 10.99,27.11 11.43,27.56 25.4,27.56 26.16,26.8 26.16,17.53 27.94,15.75 40.54,15.75 R2.2 47.27,16.99 插接口.8
TX0: length 54.8
  Top Layer w0.254: 插接口.6 48.89,17.91 40.13,17.91 39.37,17.15 39.37,17.02 39.24,16.89 28.7,16.89 27.18,18.42 27.18,27.05 25.91,28.32 10.54,28.32 8.99,26.77 ESP8266.16
$1N2489: length 9.1
  Top Layer w0.254: CH340C.5 46.59,29.34 47.48,30.23 52.58,30.23 52.83,29.97 52.83,28.87
$1N2492: length 9.6
  Top Layer w0.254: 53.48,28.91 53.47,28.89 53.47,29.97 52.7,30.73 45.42,30.73 CH340C.6
$1N4762: length 9.2
  Top Layer w0.254: R2.1 42.8,19.94 42.8,25.02 43.31,25.53 CH340C.2
$1N5427: length 10
  Top Layer w0.254: CH340C.14 37.97,26.8 36.7,28.07 33.27,28.07 32.73,27.52 32.73,27.09 ; Q1.2 32.83,26.98 32.73,27.09 ; 32.73,27.09 R3.2
$1N6150: length 1.9
  Top Layer w0.254: R4.1 34.73,27.08 Q1.1
$1N6309: length 1.8
  Top Layer w0.254: 32.64,29.11 32.77,29.24 32.77,30.81 Q2.1
$1N11619: length 5.9
  Top Layer w0.254: 12.83,4.32 10.32,6.82 RST/USER.2
$1N11632: length 3.1
  Bottom Layer w0.254: FLASH.4 9.14,27.42 R10.1
$1N12597: length 7
  Top Layer w0.254: CH340C.13 37.97,28.07 36.96,29.08 R4.2 34.73,29.15 Q2.2
$1N12808: length 12.9
  Top Layer w0.254: CH340C.3 42.29,26.8 41.78,26.29 41.78,21.46 41.4,21.08 40,21.08 39.37,20.45 39.37,18.95
$1N12994: length 6.4
  Top Layer w0.254: C14.2 50.42,25.91 48.26,28.07 CH340C.4
$1N28480: length 10.6
  Bottom Layer w0.254: OLED1.14 39.29,12.75 C11.2 C10.2
$1N28820: length 15.7
  Bottom Layer w0.254: OLED1.13 40.23,13.34 36.2,13.34 35.31,12.45 29.97,12.45 29.21,11.68 C9.2
$1N39199: length 4.9
  Top Layer w0.508: 电源.2 23.88,31.88 U1.2

## Copper pours and planes (outline as drawn; the poured copper is in the pictures)
GND on Top Layer: -4.57,36.83 63.63,36.83 63.63,-1.27 -4.57,-1.27
GND on Bottom Layer: -2.79,36.32 62.36,36.32 62.36,-2.41 -2.79,-2.41

## Text on the board
Bottom Silkscreen Layer: CS | CLK | MISO | VDD / 5V | GND | TX | RST | MOSI | RX
